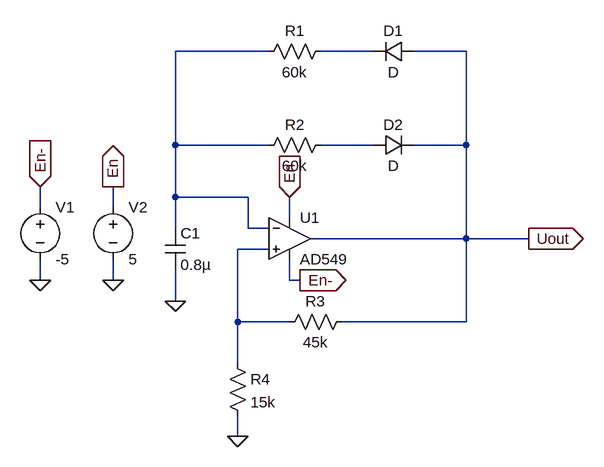
[diagram p0: schematic Draft2.asc]
Draft2.asc, the LTspice schematic file:
Version 4
SHEET 1 916 808
WIRE 400 176 256 176
WIRE 560 176 480 176
WIRE 704 176 624 176
WIRE 256 320 256 176
WIRE 400 320 256 320
WIRE 560 320 480 320
WIRE 704 320 704 176
WIRE 704 320 624 320
WIRE 256 400 256 320
WIRE 368 400 256 400
WIRE 48 416 48 384
WIRE 160 416 160 384
WIRE 432 432 432 400
WIRE 256 448 256 400
WIRE 368 448 368 400
WIRE 400 448 368 448
WIRE 704 464 704 320
WIRE 704 464 464 464
WIRE 800 464 704 464
WIRE 400 480 352 480
WIRE 48 528 48 496
WIRE 160 528 160 496
WIRE 432 528 432 496
WIRE 448 528 432 528
WIRE 256 560 256 512
WIRE 352 592 352 480
WIRE 432 592 352 592
WIRE 704 592 704 464
WIRE 704 592 512 592
WIRE 352 656 352 592
WIRE 352 768 352 736
FLAG 352 768 0
FLAG 256 560 0
FLAG 800 464 Uout
IOPIN 800 464 Out
FLAG 432 400 En
IOPIN 432 400 In
FLAG 448 528 En-
IOPIN 448 528 Out
FLAG 160 384 En
IOPIN 160 384 Out
FLAG 160 528 0
FLAG 48 384 En-
IOPIN 48 384 In
FLAG 48 528 0
SYMBOL res 496 160 R90
WINDOW 0 0 56 VBottom 2
WINDOW 3 32 56 VTop 2
SYMATTR InstName R1
SYMATTR Value 60k
SYMBOL res 496 304 R90
WINDOW 0 0 56 VBottom 2
WINDOW 3 32 56 VTop 2
SYMATTR InstName R2
SYMATTR Value 60k
SYMBOL diode 624 160 R90
WINDOW 0 0 32 VBottom 2
WINDOW 3 32 32 VTop 2
SYMATTR InstName D1
SYMBOL diode 560 336 R270
WINDOW 0 32 32 VTop 2
WINDOW 3 0 32 VBottom 2
SYMATTR InstName D2
SYMBOL cap 240 448 R0
SYMATTR InstName C1
SYMATTR Value 0.8µ
SYMBOL res 528 576 R90
WINDOW 0 0 56 VBottom 2
WINDOW 3 32 56 VTop 2
SYMATTR InstName R3
SYMATTR Value 45k
SYMBOL res 336 640 R0
SYMATTR InstName R4
SYMATTR Value 15k
SYMBOL voltage 160 400 R0
SYMATTR InstName V2
SYMATTR Value 5
SYMBOL voltage 48 400 R0
SYMATTR InstName V1
SYMATTR Value -5
SYMBOL OpAmps\\AD549 432 400 R0
SYMATTR InstName U1

The netlist it stands for:
* Draft2.asc
R1 N002 N001 60k
R2 N003 N001 60k
D1 Uout N002 D
D2 N003 Uout D
C1 N001 0 0.8µ
R3 Uout N004 45k
R4 N004 0 15k
V2 En 0 5
V1 En- 0 -5
XU1 N004 N001 En En- Uout AD549  ; pins In+ In- V+ V- OUT
.model D D
.lib standard.dio
.backanno
.end